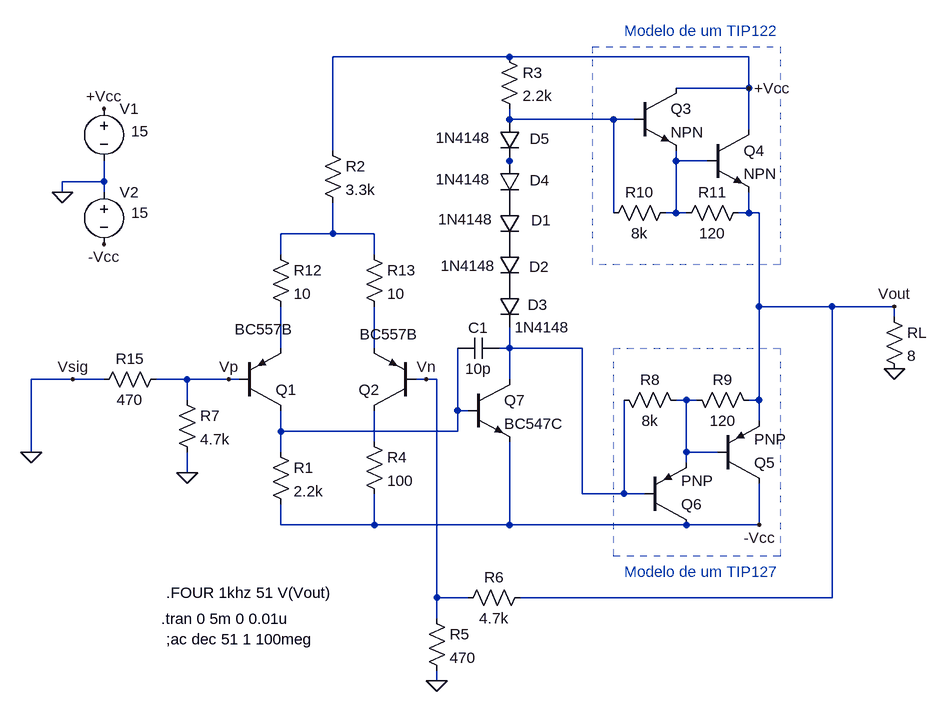
[diagram p0: schematic 7-offset-voltage.asc]
7-offset-voltage.asc, the LTspice schematic file:
Version 4
SHEET 1 2044 948
WIRE 1312 -288 1040 -288
WIRE 1680 -288 1312 -288
WIRE 1680 -240 1680 -288
WIRE 1680 -240 1568 -240
WIRE 1312 -192 1312 -208
WIRE 1472 -192 1312 -192
WIRE 1504 -192 1472 -192
WIRE 1680 -176 1680 -240
WIRE 1040 -144 1040 -288
WIRE 1312 -128 1312 -144
WIRE 1568 -128 1568 -144
WIRE 1616 -128 1568 -128
WIRE 688 -96 688 -128
WIRE 688 -96 624 -96
WIRE 624 -80 624 -96
WIRE 688 -80 688 -96
WIRE 1472 -48 1472 -192
WIRE 1568 -48 1568 -128
WIRE 1568 -48 1552 -48
WIRE 1584 -48 1568 -48
WIRE 1680 -48 1680 -80
WIRE 1680 -48 1664 -48
WIRE 1696 -48 1680 -48
WIRE 1040 -16 1040 -64
WIRE 1040 -16 960 -16
WIRE 1104 -16 1040 -16
WIRE 960 16 960 -16
WIRE 1104 16 1104 -16
WIRE 1696 96 1696 -48
WIRE 1808 96 1696 96
WIRE 1904 96 1808 96
WIRE 1904 112 1904 96
WIRE 960 160 960 96
WIRE 1104 160 1104 96
WIRE 1312 160 1312 128
WIRE 1312 160 1296 160
WIRE 1424 160 1312 160
WIRE 640 208 576 208
WIRE 688 208 640 208
WIRE 816 208 768 208
WIRE 880 208 816 208
WIRE 896 208 880 208
WIRE 1184 208 1168 208
WIRE 1200 208 1184 208
WIRE 1312 208 1312 160
WIRE 816 240 816 208
WIRE 1584 240 1568 240
WIRE 1600 240 1584 240
WIRE 1696 240 1696 96
WIRE 1696 240 1680 240
WIRE 1232 256 1232 160
WIRE 1248 256 1232 256
WIRE 1696 272 1696 240
WIRE 960 288 960 256
WIRE 1232 288 1232 256
WIRE 1232 288 960 288
WIRE 1104 304 1104 256
WIRE 576 320 576 208
WIRE 960 320 960 288
WIRE 1584 320 1584 240
WIRE 1632 320 1584 320
WIRE 1584 336 1584 320
WIRE 816 352 816 320
WIRE 1424 384 1424 160
WIRE 1488 384 1488 240
WIRE 1488 384 1424 384
WIRE 1520 384 1488 384
WIRE 960 432 960 400
WIRE 1104 432 1104 384
WIRE 1104 432 960 432
WIRE 1312 432 1312 304
WIRE 1312 432 1104 432
WIRE 1584 432 1312 432
WIRE 1696 432 1696 368
WIRE 1696 432 1584 432
WIRE 1200 544 1200 208
WIRE 1248 544 1200 544
WIRE 1808 544 1808 96
WIRE 1808 544 1328 544
WIRE 1200 576 1200 544
WIRE 1200 672 1200 656
FLAG 576 320 0
FLAG 624 -80 0
FLAG 688 -208 +Vcc
FLAG 688 0 -Vcc
FLAG 1904 192 0
FLAG 1200 672 0
FLAG 1904 96 Vout
FLAG 816 352 0
FLAG 880 208 Vp
FLAG 1184 208 Vn
FLAG 640 208 Vsig
FLAG 1680 -240 +Vcc
FLAG 1696 432 -Vcc
SYMBOL res 1184 560 R0
SYMATTR InstName R5
SYMATTR Value 470
SYMBOL voltage 688 -224 R0
WINDOW 123 42 82 Left 2
WINDOW 39 0 0 Left 2
WINDOW 3 42 50 Left 2
SYMATTR Value 15
SYMATTR InstName V1
SYMBOL voltage 688 -96 R0
WINDOW 123 42 76 Left 2
WINDOW 39 0 0 Left 2
WINDOW 3 42 48 Left 2
SYMATTR Value 15
SYMATTR InstName V2
SYMBOL res 1888 96 R0
SYMATTR InstName RL
SYMATTR Value 8
SYMBOL res 1344 528 R90
WINDOW 0 0 56 VBottom 2
WINDOW 3 32 56 VTop 2
SYMATTR InstName R6
SYMATTR Value 4.7k
SYMBOL res 800 224 R0
SYMATTR InstName R7
SYMATTR Value 4.7k
SYMBOL res 784 192 R90
WINDOW 0 0 56 VBottom 2
WINDOW 3 32 56 VTop 2
SYMATTR InstName R15
SYMATTR Value 470
SYMBOL pnp 896 256 M180
WINDOW 3 -7 125 Left 2
SYMATTR Value BC557B
SYMATTR InstName Q1
SYMBOL pnp 1168 256 R180
WINDOW 3 -3 117 Left 2
SYMATTR Value BC557B
SYMATTR InstName Q2
SYMBOL res 944 304 R0
SYMATTR InstName R1
SYMATTR Value 2.2k
SYMBOL res 1024 -160 R0
SYMATTR InstName R2
SYMATTR Value 3.3k
SYMBOL res 1296 -304 R0
SYMATTR InstName R3
SYMATTR Value 2.2k
SYMBOL res 1088 288 R0
SYMATTR InstName R4
SYMATTR Value 100
SYMBOL res 1472 224 M90
WINDOW 0 0 56 VBottom 2
WINDOW 3 32 56 VTop 2
SYMATTR InstName R8
SYMATTR Value 8k
SYMBOL res 1584 224 M90
WINDOW 0 0 56 VBottom 2
WINDOW 3 32 56 VTop 2
SYMATTR InstName R9
SYMATTR Value 120
SYMBOL npn 1504 -240 R0
SYMATTR InstName Q3
SYMBOL npn 1616 -176 R0
SYMATTR InstName Q4
SYMBOL res 1456 -32 R270
WINDOW 0 32 56 VTop 2
WINDOW 3 0 56 VBottom 2
SYMATTR InstName R10
SYMATTR Value 8k
SYMBOL res 1568 -32 R270
WINDOW 0 32 56 VTop 2
WINDOW 3 0 56 VBottom 2
SYMATTR InstName R11
SYMATTR Value 120
SYMBOL pnp 1632 368 M180
SYMATTR InstName Q5
SYMBOL pnp 1520 432 M180
SYMATTR InstName Q6
SYMBOL npn 1248 208 R0
SYMATTR InstName Q7
SYMATTR Value BC547C
SYMBOL cap 1296 144 R90
WINDOW 0 0 32 VBottom 2
WINDOW 3 32 32 VTop 2
SYMATTR InstName C1
SYMATTR Value 10p
SYMBOL diode 1296 -64 R0
WINDOW 0 49 27 Left 2
WINDOW 3 -94 26 Left 2
SYMATTR InstName D1
SYMATTR Value 1N4148
SYMBOL diode 1296 0 R0
WINDOW 0 46 35 Left 2
WINDOW 3 -90 33 Left 2
SYMATTR InstName D2
SYMATTR Value 1N4148
SYMBOL diode 1296 64 R0
WINDOW 0 44 29 Left 2
SYMATTR InstName D3
SYMATTR Value 1N4148
SYMBOL diode 1296 -128 R0
WINDOW 0 47 30 Left 2
WINDOW 3 -98 28 Left 2
SYMATTR InstName D4
SYMATTR Value 1N4148
SYMBOL diode 1296 -192 R0
WINDOW 0 47 30 Left 2
WINDOW 3 -98 28 Left 2
SYMATTR InstName D5
SYMATTR Value 1N4148
SYMBOL res 944 0 R0
SYMATTR InstName R12
SYMATTR Value 10
SYMBOL res 1088 0 R0
SYMATTR InstName R13
SYMATTR Value 10
TEXT 776 576 Left 2 !.tran 0 5m 0 0.01u
TEXT 784 536 Left 2 !.FOUR 1khz 51 V(Vout)
TEXT 784 608 Left 2 !;ac dec 51 1 100meg
TEXT 1488 -328 Left 2 ;Modelo de um TIP122
TEXT 1488 504 Left 2 ;Modelo de um TIP127
RECTANGLE Normal 1728 32 1440 -304 2
RECTANGLE Normal 1728 480 1472 160 2

The netlist it stands for:
* 7-offset-voltage.asc
R5 Vn 0 470
V1 +Vcc 0 15
V2 0 -Vcc 15
RL Vout 0 8
R6 Vout Vn 4.7k
R7 Vp 0 4.7k
R15 Vp 0 470
Q1 N009 Vp N005 0 BC557B
Q2 N010 Vn N006 0 BC557B
R1 N009 -Vcc 2.2k
R2 +Vcc N004 3.3k
R3 +Vcc N001 2.2k
R4 N010 -Vcc 100
R8 N007 N008 8k
R9 N008 Vout 120
Q3 +Vcc N001 N003 0 NPN
Q4 +Vcc N003 Vout 0 NPN
R10 N001 N003 8k
R11 N003 Vout 120
Q5 -Vcc N008 Vout 0 PNP
Q6 -Vcc N007 N008 0 PNP
Q7 N007 N009 -Vcc 0 BC547C
C1 N007 N009 10p
D1 P001 P002 1N4148
D2 P002 P003 1N4148
D3 P003 N007 1N4148
D4 N002 P001 1N4148
D5 N001 N002 1N4148
R12 N004 N005 10
R13 N004 N006 10
.model D D
.lib standard.dio
.model NPN NPN
.model PNP PNP
.lib standard.bjt
.tran 0 5m 0 0.01u
.FOUR 1khz 51 V(Vout)
;ac dec 51 1 100meg
* Modelo de um TIP122
* Modelo de um TIP127
.backanno
.end